# EAGLE schematic cpu (EAGLE 9.5.0)
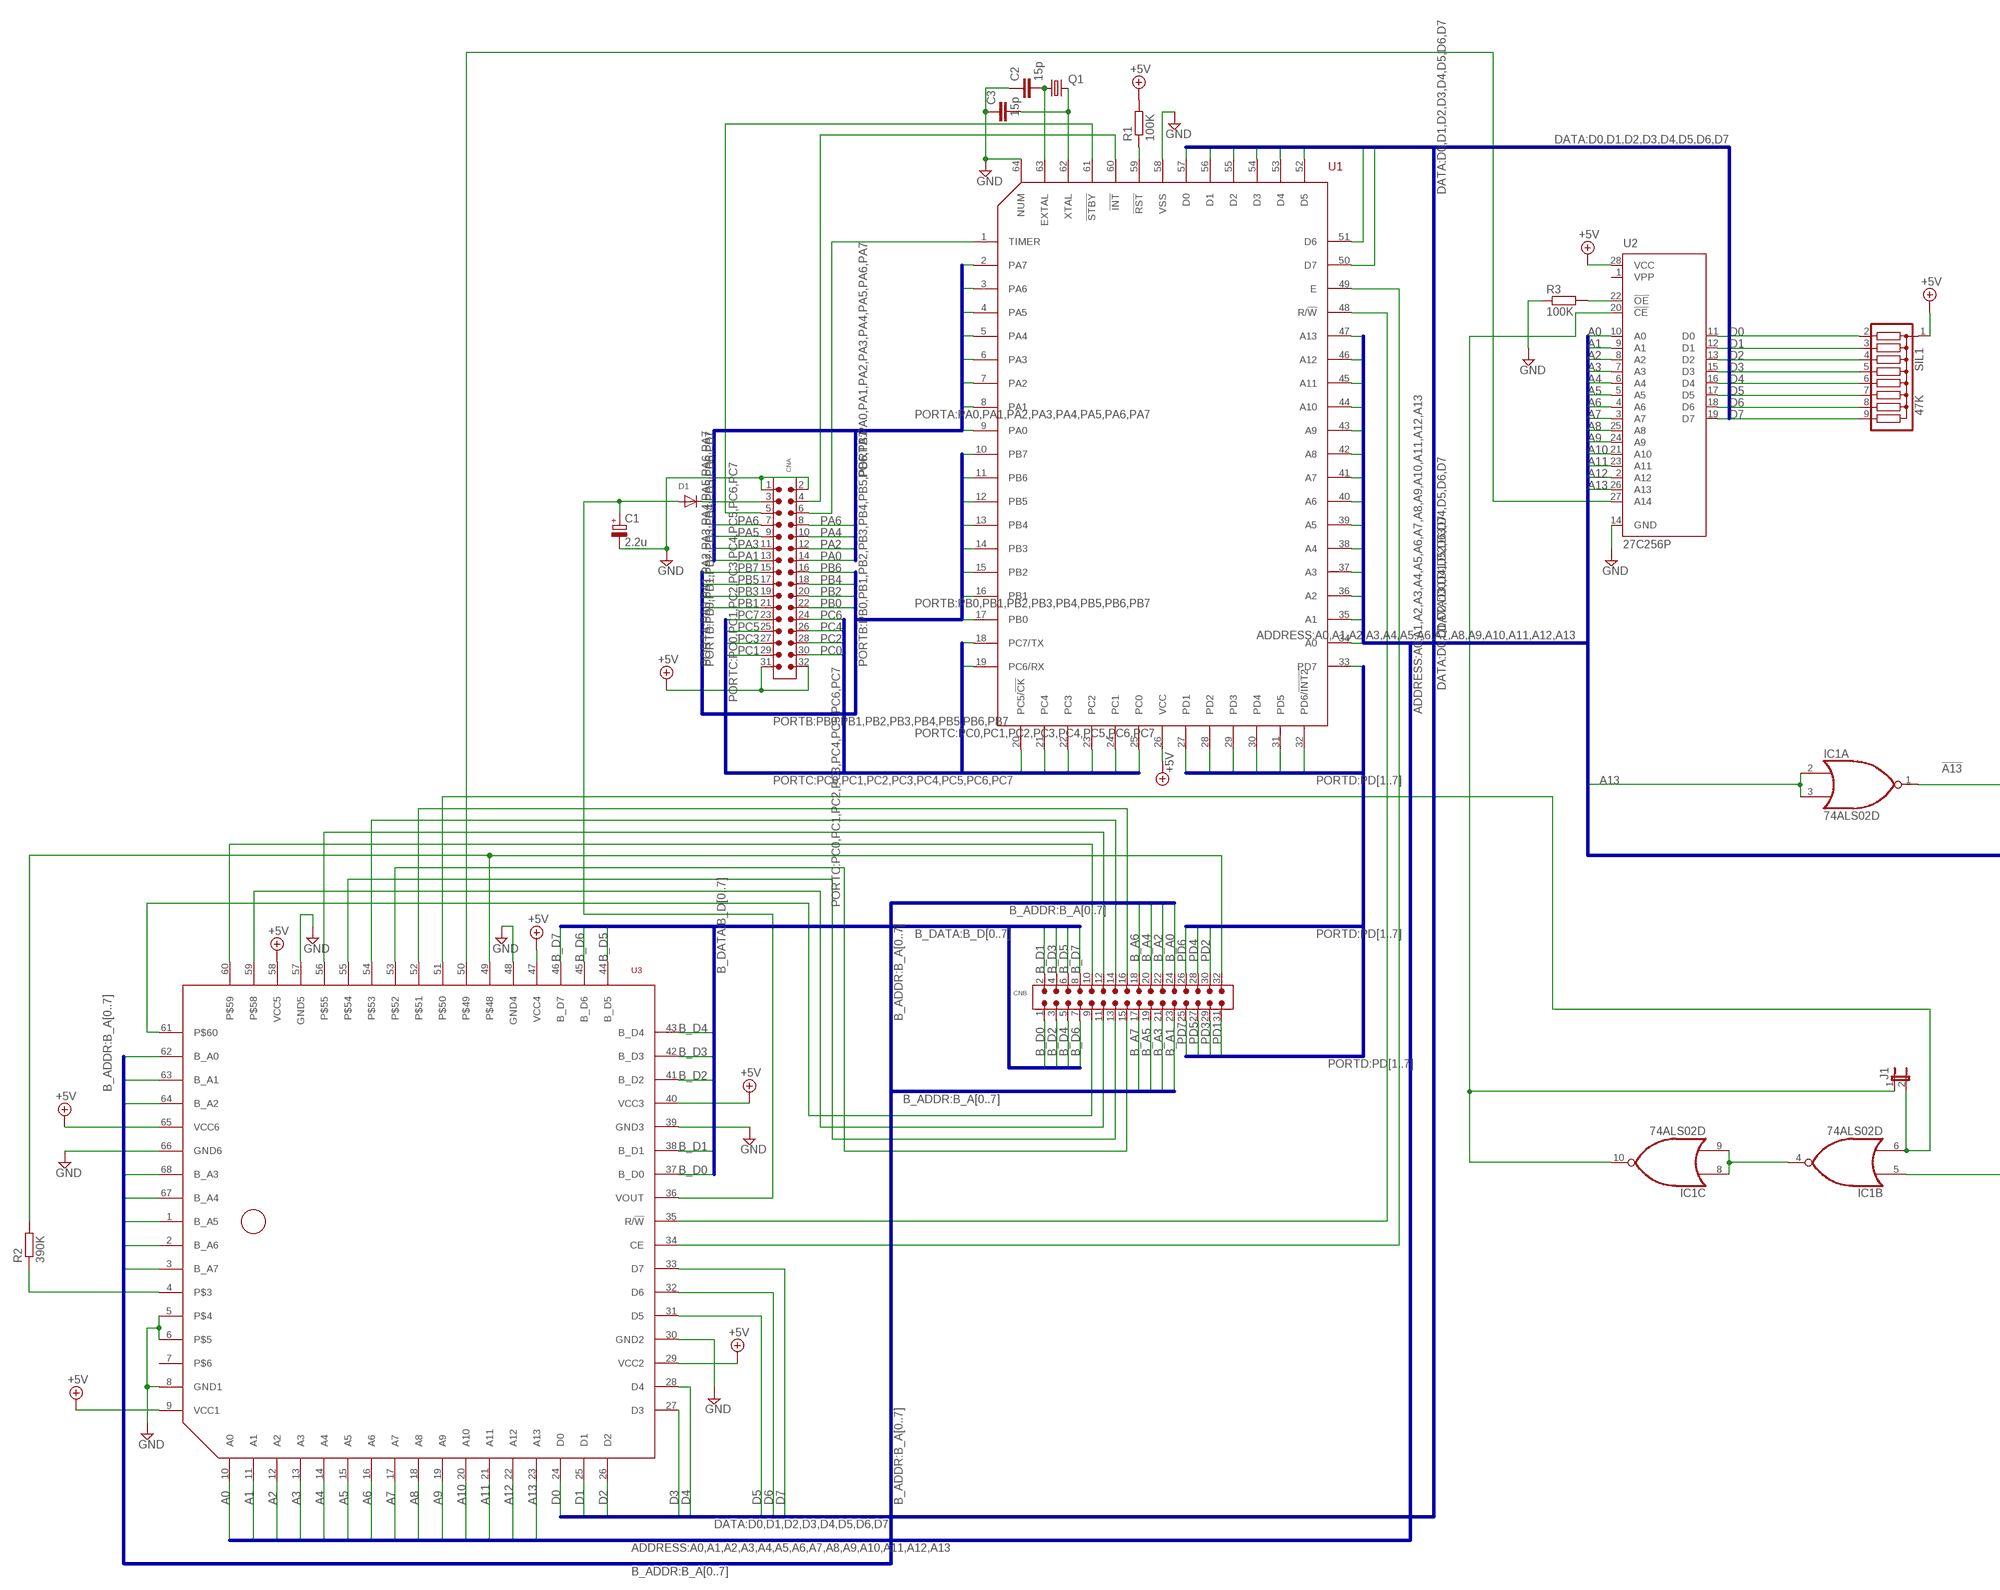
[diagram p0: schematic, sheet 1, part 1 of 2]
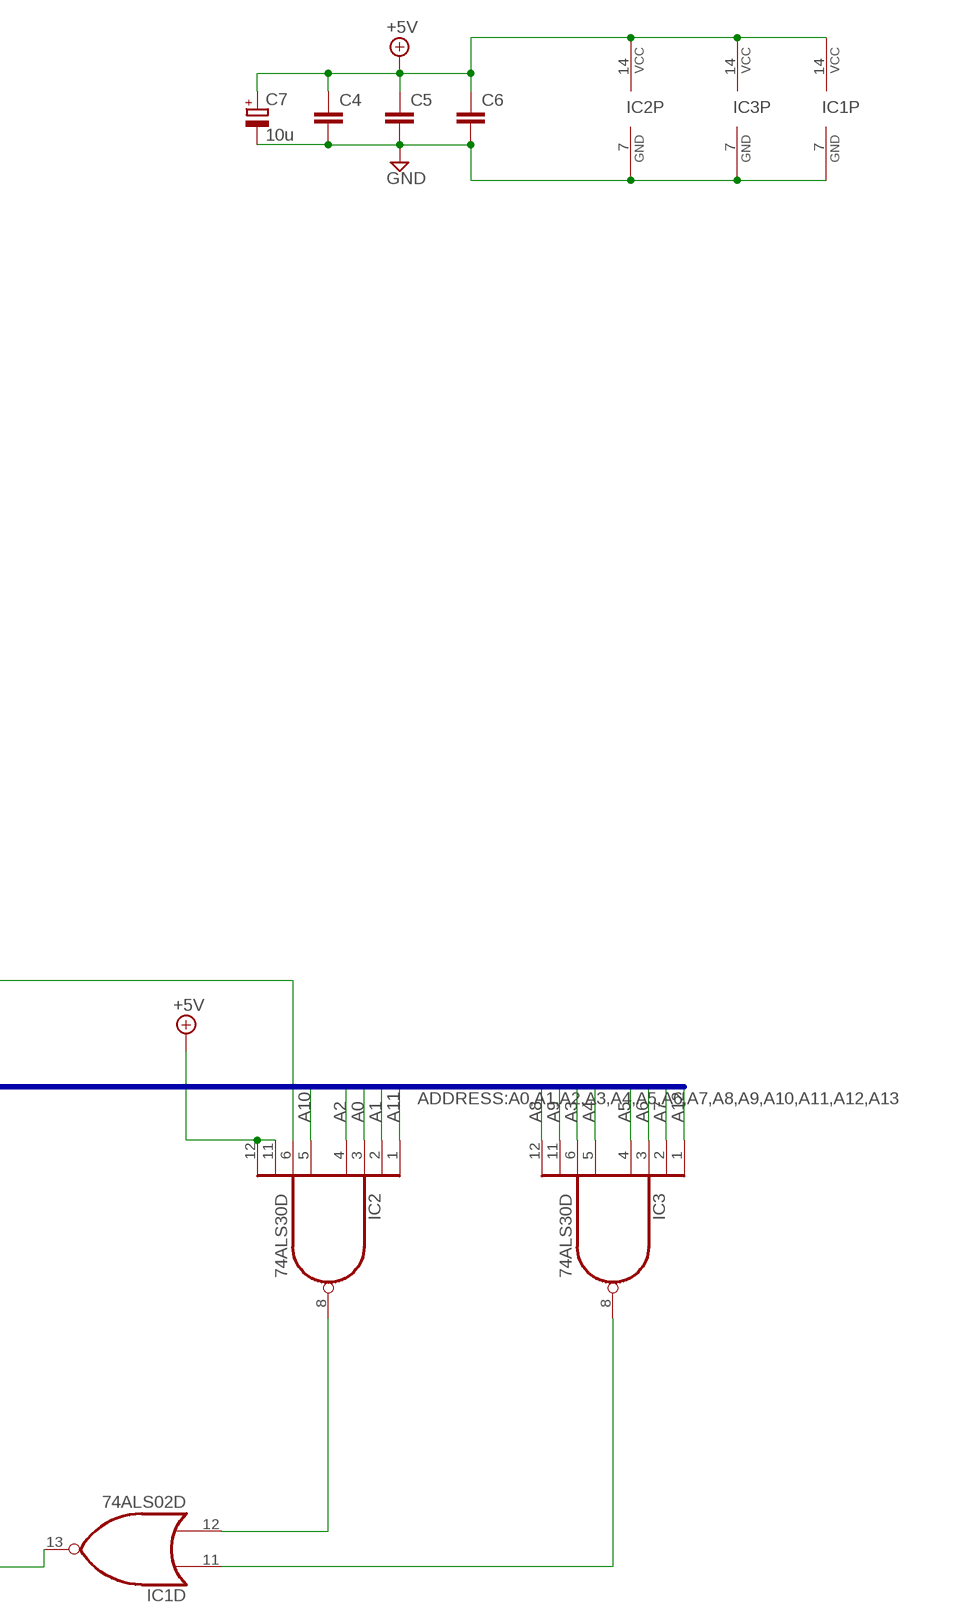
[diagram p1: schematic, sheet 1, part 2 of 2]

## Parts
C1  2.2u  CPOL-EUE15-5AXIAL  [E15-5]
C2  15p  C-EU075-032X103  [C075-032X103]
C3  15p  C-EU075-032X103  [C075-032X103]
C4  C-EU075-032X103  [C075-032X103]
C5  C-EU075-032X103  [C075-032X103]
C6  C-EU075-032X103  [C075-032X103]
C7  10u  CPOL-EUE2.5-6  [E2,5-6]
CNA  6130XX21121_61303221121  [61303221121]
CNB  6130XX21121_61303221121  [61303221121]
D1  DIODEDO-1N4148  [DO-1N4148]
IC1  74ALS02D  [SO14]
IC2  74ALS30D  [SO14]
IC3  74ALS30D  [SO14]
J1  JP1E  [JP1]
Q1  CRYSTALHC49U-H  [HC49U-H]
R1  100K  R-EU_0204/7  [0204/7]
R2  390K  R-EU_0204/7  [0204/7]
R3  100K  R-EU_0204/7  [0204/7]
SIL1  47K  G08R  [SIL9]
U1  HD6305Y2  [QFP64]
U2  27C256P  [DIL28-6]
U3  SCL1054-V4  [PLCC68]

## Nets
43: CNB.16 U3.52
44: CNB.15 U3.53
45: CNB.14 U3.54
46: CNB.13 U3.55
47: CNB.12 U3.56
50: CNB.11 U3.59
51: CNB.10 U3.60
52: CNB.9 U3.61
!A13: IC1.1(A:O) IC2.6(I5)
+5V: C4.1 C5.1 C6.1 C7.+ CNA.31 CNA.32 IC1.14(P:VCC) IC2.11(I6) IC2.12(I7) IC2.14(VCC) IC3.14(VCC) R1.2 SIL1.1 U1.26(VCC) U2.28(VCC) U3.9(VCC1) U3.29(VCC2) U3.40(VCC3) U3.47(VCC4) U3.58(VCC5) U3.65(VCC6)
A0: IC2.3(I2) U1.34(A0) U2.10(A0) U3.10(A0)
A1: IC2.2(I1) U1.35(A1) U2.9(A1) U3.11(A1)
A2: IC2.4(I3) U1.36(A2) U2.8(A2) U3.12(A2)
A3: IC3.6(I5) U1.37(A3) U2.7(A3) U3.13(A3)
A4: IC3.5(I4) U1.38(A4) U2.6(A4) U3.14(A4)
A5: IC3.4(I3) U1.39(A5) U2.5(A5) U3.15(A5)
A6: IC3.3(I2) U1.40(A6) U2.4(A6) U3.16(A6)
A7: IC3.2(I1) U1.41(A7) U2.3(A7) U3.17(A7)
A8: IC3.12(I7) U1.42(A8) U2.25(A8) U3.18(A8)
A9: IC3.11(I6) U1.43(A9) U2.24(A9) U3.19(A9)
A10: IC2.5(I4) U1.44(A10) U2.21(A10) U3.20(A10)
A11: IC2.1(I0) U1.45(A11) U2.23(A11) U3.21(A11)
A12: IC3.1(I0) U1.46(A12) U2.2(A12) U3.22(A12)
A13: IC1.2(A:I0) IC1.3(A:I1) U1.47(A13) U2.26(A13) U3.23(A13)
B_A0: CNB.24 U3.62(B_A0)
B_A1: CNB.23 U3.63(B_A1)
B_A2: CNB.22 U3.64(B_A2)
B_A3: CNB.21 U3.68(B_A3)
B_A4: CNB.20 U3.67(B_A4)
B_A5: CNB.19 U3.1(B_A5)
B_A6: CNB.18 U3.2(B_A6)
B_A7: CNB.17 U3.3(B_A7)
B_D0: CNB.1 U3.37(B_D0)
B_D1: CNB.2 U3.38(B_D1)
B_D2: CNB.3 U3.41(B_D2)
B_D3: CNB.4 U3.42(B_D3)
B_D4: CNB.5 U3.43(B_D4)
B_D5: CNB.6 U3.44(B_D5)
B_D6: CNB.7 U3.45(B_D6)
B_D7: CNB.8 U3.46(B_D7)
D0: SIL1.2 U1.57(D0) U2.11(D0) U3.24(D0)
D1: SIL1.3 U1.56(D1) U2.12(D1) U3.25(D1)
D2: SIL1.4 U1.55(D2) U2.13(D2) U3.26(D2)
D3: SIL1.5 U1.54(D3) U2.15(D3) U3.27(D3)
D4: SIL1.6 U1.53(D4) U2.16(D4) U3.28(D4)
D5: SIL1.7 U1.52(D5) U2.17(D5) U3.31(D5)
D6: SIL1.8 U1.51(D6) U2.18(D6) U3.32(D6)
D7: SIL1.9 U1.50(D7) U2.19(D7) U3.33(D7)
GND: C1.- C2.1 C3.1 C4.2 C5.2 C6.2 C7.- CNA.1 CNA.2 IC1.7(P:GND) IC2.7(GND) IC3.7(GND) R3.1 U1.58(VSS) U1.64(NUM) U2.14(GND) U3.5 U3.6 U3.8(GND1) U3.30(GND2) U3.39(GND3) U3.48(GND4) U3.57(GND5) U3.66(GND6)
N$1: IC1.5(B:I0) IC1.13(D:O)
N$2: IC1.12(D:I1) IC2.8(O)
N$3: IC1.11(D:I0) IC3.8(O)
N$4: IC1.4(B:O) IC1.8(C:I0) IC1.9(C:I1)
N$5: IC1.10(C:O) J1.1 U2.20(!CE)
N$6: IC1.6(B:I1) J1.2 U3.51
N$7: U2.27(A14) U3.50
N$8: R3.2 U2.22(!OE)
N$9: R1.1 U1.59(!RST)
N$10: CNA.4 U1.60(!INT)
N$11: CNA.6 U1.1(TIMER)
N$12: CNA.5 U1.61(!STBY)
N$13: C2.2 Q1.1 U1.63(EXTAL)
N$14: C3.2 Q1.2 U1.62(XTAL)
N$15: C1.+ D1.A U3.36(VOUT)
N$16: CNA.3 D1.C
N$17: CNB.32 R2.2 U3.49
N$18: R2.1 U3.4
N$20: U1.48(R/!W) U3.35(R/!W)
N$21: U1.49(E) U3.34(CE)
PA0: CNA.14 U1.9(PA0)
PA1: CNA.13 U1.8(PA1)
PA2: CNA.12 U1.7(PA2)
PA3: CNA.11 U1.6(PA3)
PA4: CNA.10 U1.5(PA4)
PA5: CNA.9 U1.4(PA5)
PA6: CNA.7 CNA.8 U1.3(PA6)
PA7: U1.2(PA7)
PB0: CNA.22 U1.17(PB0)
PB1: CNA.21 U1.16(PB1)
PB2: CNA.20 U1.15(PB2)
PB3: CNA.19 U1.14(PB3)
PB4: CNA.18 U1.13(PB4)
PB5: CNA.17 U1.12(PB5)
PB6: CNA.16 U1.11(PB6)
PB7: CNA.15 U1.10(PB7)
PC0: CNA.30 U1.25(PC0)
PC1: CNA.29 U1.24(PC1)
PC2: CNA.28 U1.23(PC2)
PC3: CNA.27 U1.22(PC3)
PC4: CNA.26 U1.21(PC4)
PC5: CNA.25 U1.20(PC5/!CK)
PC6: CNA.24 U1.19(PC6/RX)
PC7: CNA.23 U1.18(PC7/TX)
PD1: CNB.31 U1.27(PD1)
PD2: CNB.30 U1.28(PD2)
PD3: CNB.29 U1.29(PD3)
PD4: CNB.28 U1.30(PD4)
PD5: CNB.27 U1.31(PD5)
PD6: CNB.26 U1.32(PD6/!INT2)
PD7: CNB.25 U1.33(PD7)
Unconnected: U2.1(VPP) U3.7

## Buses
PORTA:PA0,PA1,PA2,PA3,PA4,PA5,PA6,PA7
ADDRESS:A0,A1,A2,A3,A4,A5,A6,A7,A8,A9,A10,A11,A12,A13
DATA:D0,D1,D2,D3,D4,D5,D6,D7
PORTB:PB0,PB1,PB2,PB3,PB4,PB5,PB6,PB7
PORTC:PC0,PC1,PC2,PC3,PC4,PC5,PC6,PC7
PORTD:PD[1..7]
B_ADDR:B_A[0..7]
B_DATA:B_D[0..7]

## Library data of the parts
C1 C7 = rcl:CPOL-EU: POLARIZED CAPACITOR, European symbol; SPICEPREFIX: C
C2-C6 = rcl:C-EU: CAPACITOR, European symbol; SPICEPREFIX: C
CNA CNB = Wurth_Connectors_WR-PHD:6130XX21121_61303221121: WR-PHD 2.54 mm THT Dual Pin Header ARTICLE PROPERTIES: Pins:4;​ 6;​ 8;​ 10;​ 12;​ 14;​ 16;​ 18;​ 20;​ 22;​ 24;​ 26;​ 28;​ 30;​ 32;​ 34;​ 36;​ 40;​ 44;​ 64;​ 72;​ 80 KIND PROPERTIES: Pitch：2.54 mm Quality Class:3 as per CECC 75 301-802 Rows：Dual Gender：Pin Header Type：Board Stacker MATERIAL PROPERTIES: Insulator Material :PA6T Insulator Flammability Rating:UL94 V-0 Contact Material:Copper Alloy Contact Plating:Gold Contact Type:Stamped GENERAL INFORMATION Operating Temperature:-40 up to +105 °C Compliance:Lead free / RoHS ELECTRICAL PROPERTIES: Rated Current:3 A IR 1:3 A Withstanding Voltage:500 V (AC) Contact Resistance:20 mΩ RISO:1000 MΩ CERTIFICATION UL Approval:E323964 PACKAGING PROPERTIES Packaging:Bag <https://katalog.we-online.com/media/images/v2/o33215v209%20Family_WR-PHD_6130xx21121.jpg> Details see: https://katalog.we-online.com/en/em/PHD_2_54_THT_DUAL_PIN_HEADER_6130XX21121 Updated by Yingchun,Shan 2019-10-16 2019 (C) Würth Elektronik; DATASHEET-URL: https://katalog.we-online.com/em/datasheet/61303221121.pdf; GENDER: Pin Header; IR: 3A; MATES: WR-PHD 2.54mm Angled DualSocket Header/Dual Socket Header/Dual Socket Header Bottom Entry/Dual Socket Header Bottom Entry Large/SMT Dual Socket Header/SMT Dual Socket Header Bottom Entry; PACKAGING: Bag; PART-NUMBER: 61303221121; PINS: 32; ROWS: Dual; TYPE: Board Stacker
D1 = adafruit:DIODE: Diode SMADIODE - SMA Surface Mount Package 20V 1A Schottky Diode Digikey: 641-1014-6-ND DO-1N4148 - Through Hole Small Current Diode SOD-123 20V 1 A (.5mV Vf) Schottky Diode - Digikey: MBRX120TPMSCT-ND SOD-323 10V 570mA (.38mV Vf, 3ns) Schottky Diode - Digikey: ZLLS410CT-ND SOD-523 30V 30mA Schottky Diode (RB751S-40TE61) - Digikey: RB751S-40TE61CT-ND SOT23-R/W - SOT23 Package (R = Solder Paste/Reflow Ovens, W = Hand-Soldering) BAT54Film 40V 300mA - Digikey: 497-7162-1-ND
IC1 = 74xx-us:74*02: Quad 2-input NOR gate
IC2 IC3 = 74xx-us:74*30: 8-input NAND gate
J1 = jumper:JP1E: JUMPER
Q1 = crystal:CRYSTAL: CRYSTAL; OC_FARNELL: 1666973; OC_NEWARK: unknown
R1-R3 = resistor:R-EU_: RESISTOR, European symbol
SIL1 = resistor-sil:G08R: SIL RESISTOR; OC_FARNELL: unknown; OC_NEWARK: unknown
U1 = micro-hitachi:HD6305Y2
U2 = microchip:27*256: CMOS EPROM 256 K (32 K x 8), low voltage; MF: Arrow Electronics; MPN: M27C256B15F1; OC_FARNELL: 1125431; OC_NEWARK: 93K7335
U3 = national-semiconductor:SCL1054-V4